# Altium schematic sheet 12_PoE_USB_PD.SchDoc: PoE and USB PD (part 1 of 3)
size A3; Organization: Lime Microsystems; Address1: Surrey Tech Centre; Address2: Guildford GU2 7YG; Address3: Surrey; Address4: United Kingdom; Revision: v1.2; SheetNumber: 12; SheetTotal: 13
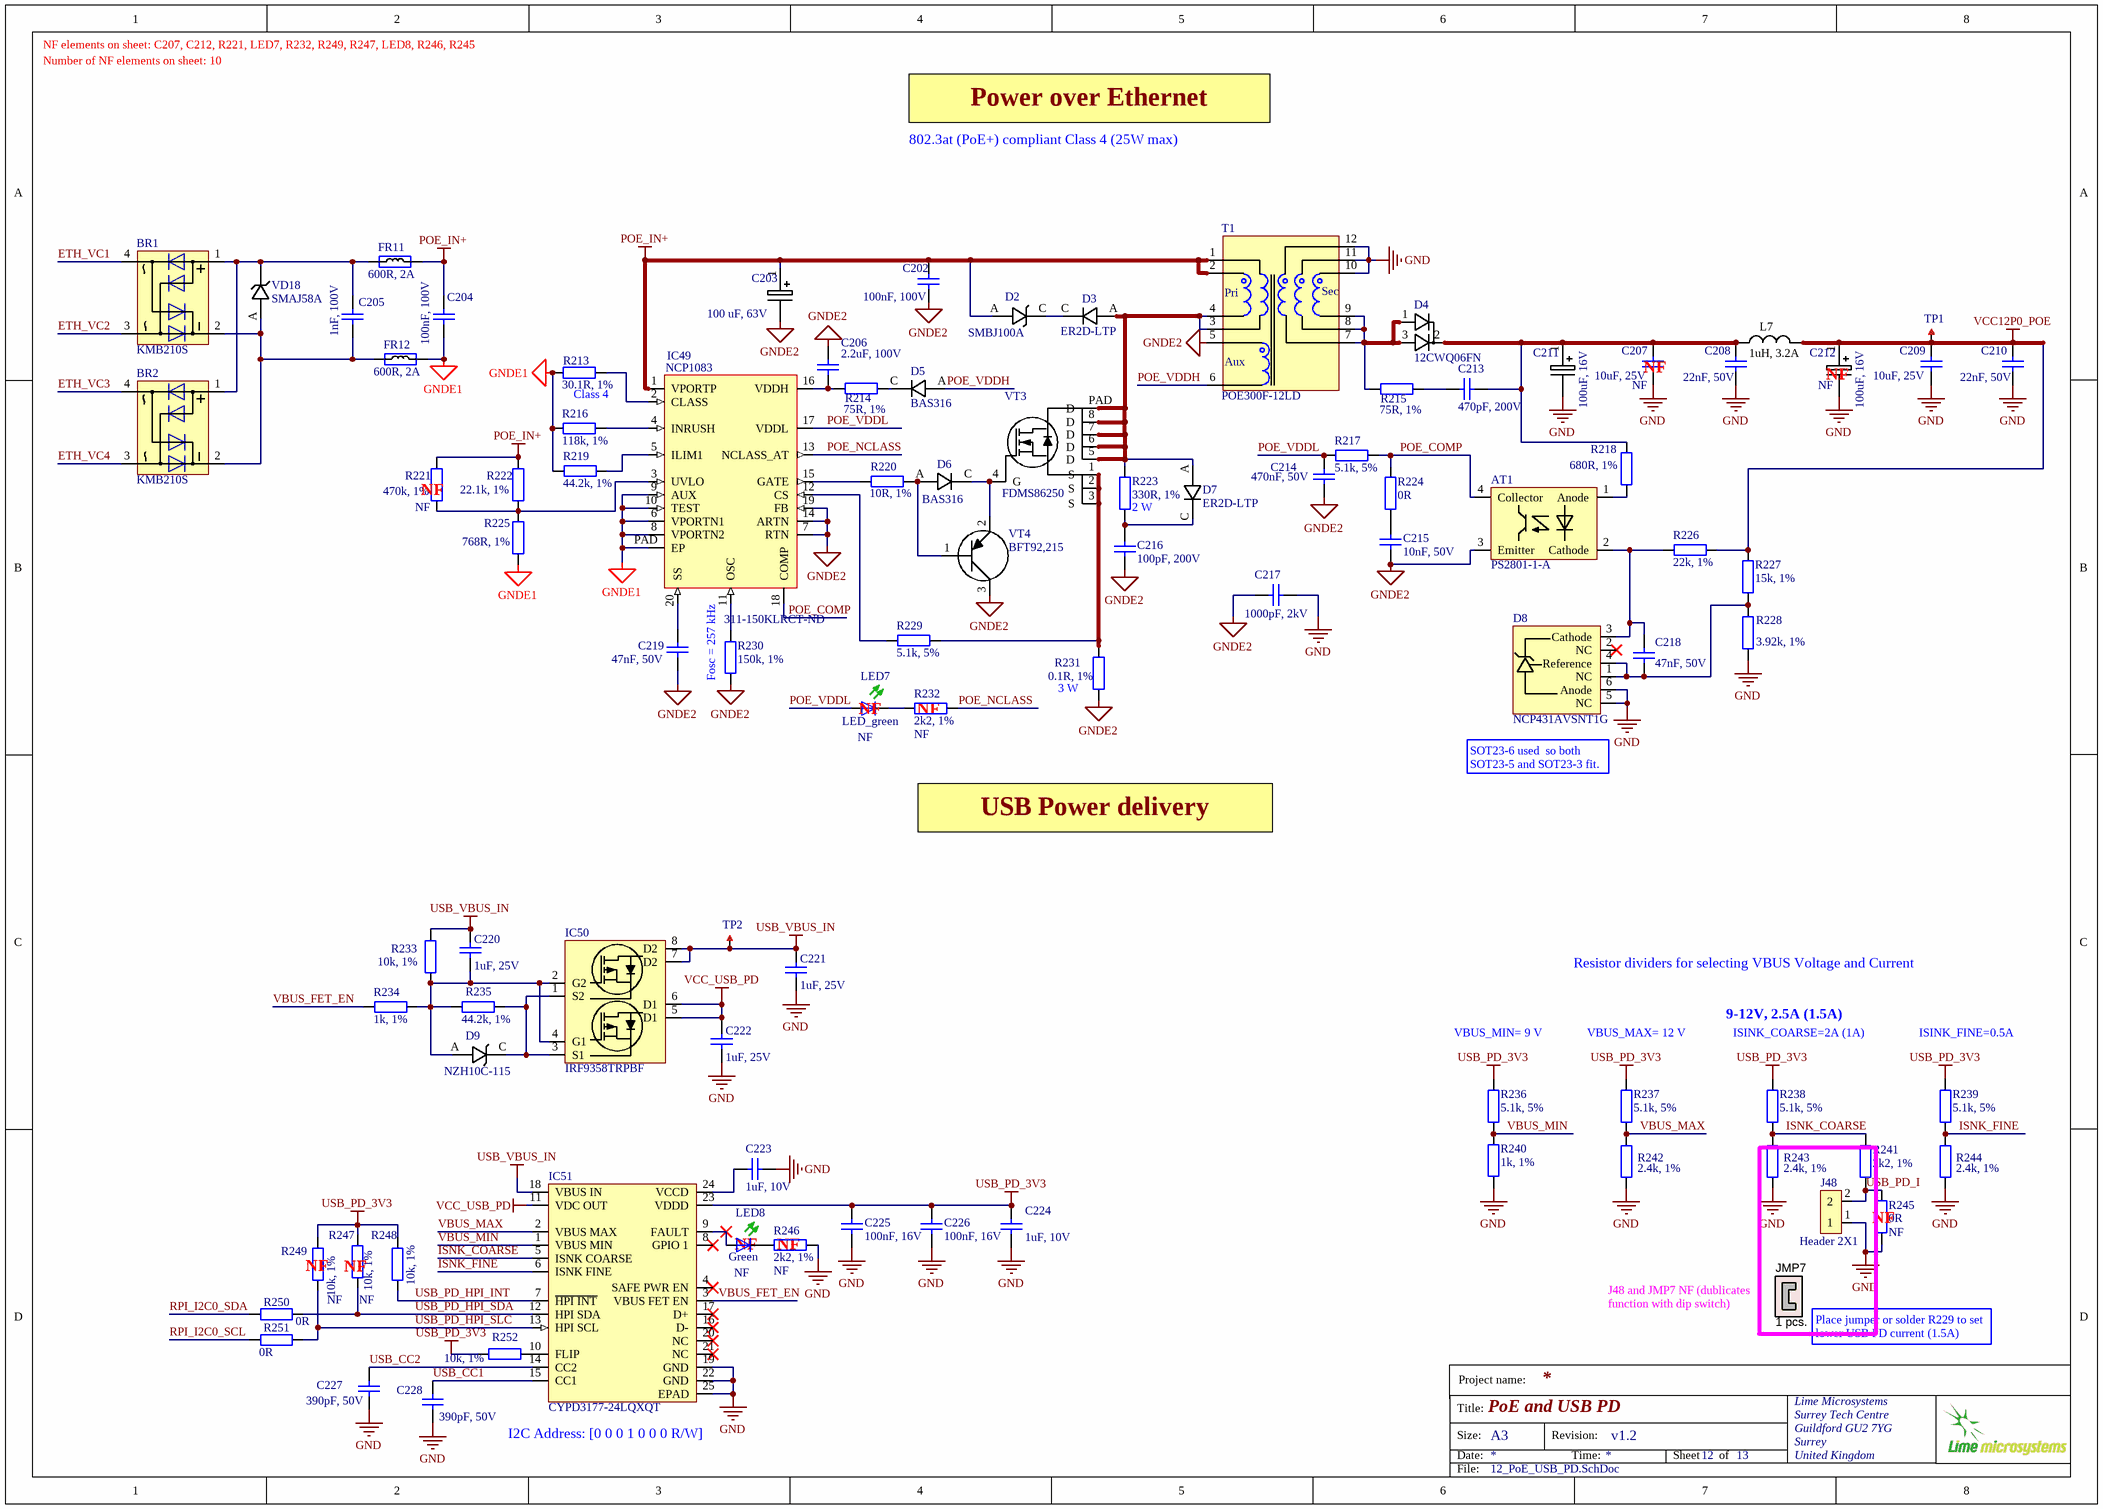
[diagram p0: 12_PoE_USB_PD.SchDoc]

## Parts
AT1  PS2801-1-A  [TCMT1107CT_optoisolator]
BR1  KMB210S  [KMB210S_RECTIFIER_BRIDGE]
BR2  KMB210S  [KMB210S_RECTIFIER_BRIDGE]
C202  100nF, 100V  [CAP0603]
C203  100 uF, 63V  [CAP_POL_D10_H10]
C204  100nF, 100V  [CAP0603]
C205  1nF, 100V  [CAP0603]
C206  2.2uF, 100V  [CAP1206]
C207  10uF, 25V  Assembly Info: NF  [CAP0805]
C208  22nF, 50V  [CAP0402]
C209  10uF, 25V  [CAP0805]
C210  22nF, 50V  [CAP0402]
C211  100uF, 16V  [CAP_POL_SIZE_F_v2]
C212  100uF, 16V  Assembly Info: NF  [CAP_POL_SIZE_F_v2]
C213  470pF, 200V  [CAP0603]
C214  470nF, 50V  [CAP0603]
C215  10nF, 50V  [CAP0402]
C216  100pF, 200V  [CAP0603]
C217  1000pF, 2kV  [CAP1812]
C218  47nF, 50V  [CAP0603]
C219  47nF, 50V  [CAP0603]
C220  1uF, 25V  [CAP0603]
C221  1uF, 25V  [CAP0603]
C222  1uF, 25V  [CAP0603]
C223  1uF, 10V  [CAP0402]
C224  1uF, 10V  [CAP0402]
C225  100nF, 16V  [CAP0402]
C226  100nF, 16V  [CAP0402]
C227  390pF, 50V  [CAP0402]
C228  390pF, 50V  [CAP0402]
D2  SMBJ100A  [SMBJ100A_DIODE_DO-214AA]
D3  ER2D-LTP  [ER2D-LTP_DIODE_DO-214AA]
D4  12CWQ06FN  [12CWQ06FN_diode_array_DPAK]
D5  BAS316  [BAS316_DIODE_SOD323]
D6  BAS316  [BAS316_DIODE_SOD323]
D7  ER2D-LTP  [ER2D-LTP_DIODE_DO-214AA]
D8  NCP431AVSNT1G  [SOT23-6]
D9  NZH10C-115  [NZH10C,115_shottky_diode_SOD123]
FR11  600R, 2A  [RES0805]
FR12  600R, 2A  [RES0805]
IC49  NCP1083  [NCP1083_PoE_controller_TSSOP20]
IC50  IRF9358TRPBF  [IRF9358TRPBF_DUAL_NMOS_SOIC8]
IC51  CYPD3177-24LQXQT  [USB_POWER_DISTR_CYPD3177_QFN24]
J48  Header 2X1  [HDR_1x2]
JMP7  1 pcs.  (mechanical)
L7  1uH, 3.2A  [NRS4018T3R3MDGJ_inductor]
LED7  LED_green  Assembly Info: NF  [LED-0603-GREEN]
LED8  Green  Assembly Info: NF  [LED-0603-GREEN]
R213  30.1R, 1%  [RES0402]
R214  75R, 1%  [RES0402]
R215  75R, 1%  [RES0402]
R216  118k, 1%  [RES0402]
R217  5.1k, 5%  [RES0402]
R218  680R, 1%  [RES0402]
R219  44.2k, 1%  [RES0402]
R220  10R, 1%  [RES0603]
R221  470k, 1%  Assembly Info: NF  [RES0402]
R222  22.1k, 1%  [RES0402]
R223  330R, 1%  [RES2512]
R224  0R  [RES0402]
R225  768R, 1%  [RES0402]
R226  22k, 1%  [RES0402]
R227  15k, 1%  [RES0402]
R228  3.92k, 1%  [RES0402]
R229  5.1k, 5%  [RES0402]
R230  150k, 1%  Supplier Part Number 1: 311-150KLRCT-ND  [RES0402]
R231  0.1R, 1%  [RES2512]
R232  2k2, 1%  Assembly Info: NF  [RES0402]
R233  10k, 1%  [RES0402]
R234  1k, 1%  [RES0402]
R235  44.2k, 1%  [RES0402]
R236  5.1k, 5%  [RES0402]
R237  5.1k, 5%  [RES0402]
R238  5.1k, 5%  [RES0402]
R239  5.1k, 5%  [RES0402]
R240  1k, 1%  [RES0402]
R241  2k2, 1%  [RES0402]
R242  2.4k, 1%  [RES0402]
R243  2.4k, 1%  [RES0402]
R244  2.4k, 1%  [RES0402]
R245  0R  Assembly Info: NF  [RES0402]
R246  2k2, 1%  Assembly Info: NF  [RES0402]
R247  10k, 1%  Assembly Info: NF  [RES0402]
R248  10k, 1%  [RES0402]
R249  10k, 1%  Assembly Info: NF  [RES0402]
R250  0R  [RES0402]
R251  0R  [RES0402]
R252  10k, 1%  [RES0402]
T1  POE300F-12LD  [POE300F50LD_TRANSFORMER]
TP1  TESTPOINT_PAD  [TP_PAD_1p5MM]  (value not drawn)  (no BOM)
TP2  TESTPOINT_PAD  [TP_PAD_1p5MM]  (value not drawn)  (no BOM)
VD18  SMAJ58A  [SMAJ58A_shottky_diode]
VT3  FDMS86250  [FDMS86250_NMOS_POWER56]
VT4  BFT92,215  [BFT92,215_PNP_STO23-3]

## Nets
GND: C207.1 C208.2 C209.1 C210.2 C211.2 C212.2 C217.1 C221.1 C222.1 C223.1 C224.1 C225.2 C226.2 C227.2 C228.2 D8.5(NC) D8.6(Anode) IC51.19(GND) IC51.22(GND) IC51.25(EPAD) J48.1 R228.2 R240.2 R242.1 R243.1 R244.1 R245.2 R246.2 T1.10 T1.11 T1.12
GNDE1: C204.1 FR12.2 IC49.6(VPORTN1) IC49.8(VPORTN2) IC49.9(AUX) IC49.10(TEST) IC49.PAD(EP) R213.1 R216.1 R219.2 R225.2
GNDE2: AT1.3(Emitter) C202.1 C203.2 C206.2 C214.1 C215.1 C216.2 C217.2 C219.1 IC49.7(RTN) IC49.14(ARTN) IC49.19(FB) R230.1 R231.1 T1.5 VT4.3(C)
POE_IN+: C202.2 C203.1 C204.2 D2.A FR11.2 IC49.1(VPORTP) R221.2 R222.2 T1.1 T1.2
USB_PD_3V3: C224.2 C225.1 C226.1 IC51.23(VDDD) R236.1 R237.1 R238.1 R239.1 R247.2 R248.2 R249.2 R252.1
USB_VBUS_IN: C220.2 C221.2 IC50.7(D2) IC50.8(D2) IC51.18(VBUS_IN) R233.2 TP2.1
VCC12P0_POE: C209.2 C210.1 C212.1 L7.2 R226.1 R227.1 TP1.1
VCC_USB_PD: C222.2 IC50.5(D1) IC50.6(D1) IC51.11(VDC_OUT)
ETH_VC1: BR1.4
ETH_VC2: BR1.3
ETH_VC3: BR2.4
ETH_VC4: BR2.3
ISNK_COARSE: IC51.5(ISNK_COARSE) R238.2 R241.2 R243.2
ISNK_FINE: IC51.6(ISNK_FINE) R239.2 R244.2
POE_COMP: AT1.4(Collector) IC49.18(COMP) R217.1 R224.1
POE_NCLASS: IC49.13(NCLASS_AT) R232.2
POE_VDDH: D5.A T1.6
POE_VDDL: C214.2 IC49.17(VDDL) LED7.A R217.2
RPI_I2C0_SCL: R251.2
RPI_I2C0_SDA: R250.2
USB_CC1: C228.1 IC51.15(CC1)
USB_CC2: C227.1 IC51.14(CC2)
USB_PD_HPI_INT: IC51.7(~{HPI_INT}) R248.1
USB_PD_HPI_SDA: IC51.12(HPI_SDA) R247.1 R250.1
USB_PD_HPI_SLC: IC51.13(HPI_SCL) R249.1 R251.1
USB_PD_I: J48.2 R241.1 R245.1
VBUS_FET_EN: IC51.3(VBUS_FET_EN) R234.2
VBUS_MAX: IC51.2(VBUS_MAX) R237.2 R242.2
VBUS_MIN: IC51.1(VBUS_MIN) R236.2 R240.1
NetAT1_1: AT1.1(Anode) R218.2
NetAT1_2: AT1.2(Cathode) C218.2 D8.3(Cathode) R226.2
NetBR1_1: BR1.1 BR2.1 C205.1 FR11.1 VD18.K
NetBR1_2: BR1.2 BR2.2 C205.2 FR12.1 VD18.A
NetC206_1: C206.1 IC49.16(VDDH) R214.1
NetC207_2: C207.2 C208.1 C211.1 C213.2 D4.2 L7.1 R218.1
NetC213_1: C213.1 R215.2
NetC215_2: C215.2 R224.2
NetC216_1: C216.1 D7.C R223.1
NetC218_1: C218.1 D8.1(NC) D8.4(Reference) R227.2 R228.1
NetC219_2: C219.2 IC49.20(SS)
NetC220_1: C220.1 D9.A IC50.2(G2) IC50.4(G1) R233.1 R234.1 R235.2
NetC223_2: C223.2 IC51.24(VCCD)
NetD2_C: D2.C D3.C
NetD3_A: D3.A D7.A R223.2 T1.3 T1.4 VT3.5(D) VT3.6(D) VT3.7(D) VT3.8(D) VT3.PAD(D)
NetD4_1: D4.1 D4.3 R215.1 T1.7 T1.8 T1.9
NetD5_C: D5.C R214.2
NetD6_A: D6.A R220.1 VT4.1(S)
NetD6_C: D6.C VT3.4(G) VT4.2(E)
NetD9_C: D9.C IC50.1(S2) IC50.3(S1) R235.1
NetIC49_2: IC49.2(CLASS) R213.2
NetIC49_3: IC49.3(UVLO) R221.1 R222.1 R225.1
NetIC49_4: IC49.4(INRUSH) R216.2
NetIC49_5: IC49.5(ILIM1) R219.1
NetIC49_11: IC49.11(OSC) R230.2
NetIC49_12: IC49.12(CS) R229.2
NetIC49_15: IC49.15(GATE) R220.2
NetIC51_9: IC51.9(FAULT) LED8.A
NetIC51_10: IC51.10(FLIP) R252.2
NetLED7_K: LED7.K(C) R232.1
NetLED8_K: LED8.K(C) R246.1
NetR229_1: R229.1 R231.2 VT3.1(S) VT3.2(S) VT3.3(S)

Not connected (* = marked no-connect by the designer): D8 2(NC)*; IC51 4(SAFE_PWR_EN)* 8(GPIO_1)* 16(D-)* 17(D+)* 20(NC)* 21(NC)*; JMP7 1 2

## Notes on the sheet
- NF elements on sheet: C207, C212, R221, LED7, R232, R249, R247, LED8, R246, R245
- Number of NF elements on sheet: 10
- 802.3at (PoE+) compliant Class 4 (25W max)
- Power over Ethernet
- (near C207) NF
- (near C212) NF
- Class 4
- (near R221) NF
- (near R223) 2 W
- Fosc = 257 kHz
- (near LED7) NF
- (near R232) NF
- (near R231) 3 W
- (near D8) SOT23-6 used  so both SOT23-5 and SOT23-3 fit.
- USB Power delivery
- Resistor dividers for selecting VBUS Voltage and Current
- (near R236) VBUS_MIN= 9 V
- (near R237) VBUS_MAX= 12 V
- 9-12V, 2.5A (1.5A)
- (near R238) ISINK_COARSE=2A (1A)
- (near R239) ISINK_FINE=0.5A
- NF
- (near R246) NF
- (near R245) NF
- (near R249) NF
- (near R247) NF
- (near JMP7) J48 and JMP7 NF (dublicates function with dip switch)
- Place jumper or solder R229 to set lower USB PD current (1.5A)
- (near IC51) I2C Address: [0 0 0 1 0 0 0 R/W]
- Project name:
- Title:
- Size:
- Date:
- A3
- Revision:
- Time:
- Sheet
- of
- File:
- (in symbol POE300F-50LD_transformer) Pri; Sec; Aux